# Altium schematic sheet CONTROL-SWITCHES.SchDoc
size A4; SheetNumber: 2; SheetTotal: 5
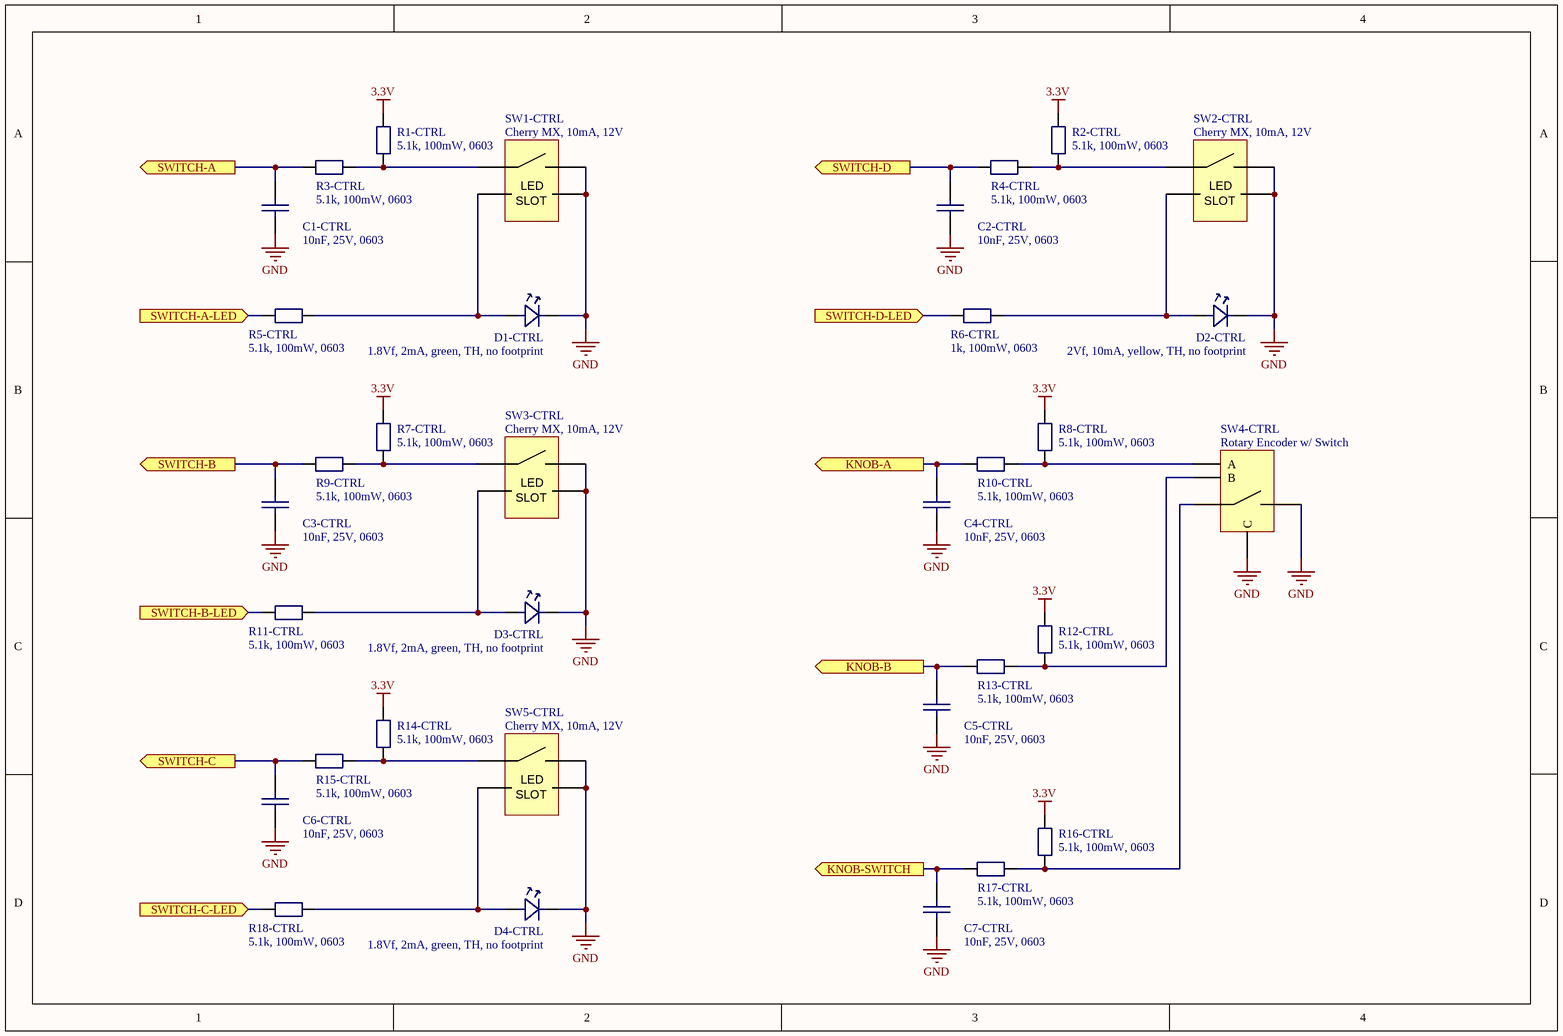
[diagram p0: CONTROL-SWITCHES.SchDoc]

## Parts
C1-CTRL  10nF, 25V, 0603  [0603 [1608]]
C2-CTRL  10nF, 25V, 0603  [0603 [1608]]
C3-CTRL  10nF, 25V, 0603  [0603 [1608]]
C4-CTRL  10nF, 25V, 0603  [0603 [1608]]
C5-CTRL  10nF, 25V, 0603  [0603 [1608]]
C6-CTRL  10nF, 25V, 0603  [0603 [1608]]
C7-CTRL  10nF, 25V, 0603  [0603 [1608]]
D1-CTRL  1.8Vf, 2mA, green, TH, no footprint  [LED 0603 [1608]]  (mechanical)
D2-CTRL  2Vf, 10mA, yellow, TH, no footprint  [LED 0603 [1608]]  (mechanical)
D3-CTRL  1.8Vf, 2mA, green, TH, no footprint  [LED 0603 [1608]]  (mechanical)
D4-CTRL  1.8Vf, 2mA, green, TH, no footprint  [LED 0603 [1608]]  (mechanical)
R1-CTRL  5.1k, 100mW, 0603  [0603 [1608]]
R2-CTRL  5.1k, 100mW, 0603  [0603 [1608]]
R3-CTRL  5.1k, 100mW, 0603  [0603 [1608]]
R4-CTRL  5.1k, 100mW, 0603  [0603 [1608]]
R5-CTRL  5.1k, 100mW, 0603  [0603 [1608]]
R6-CTRL  1k, 100mW, 0603  [0603 [1608]]
R7-CTRL  5.1k, 100mW, 0603  [0603 [1608]]
R8-CTRL  5.1k, 100mW, 0603  [0603 [1608]]
R9-CTRL  5.1k, 100mW, 0603  [0603 [1608]]
R10-CTRL  5.1k, 100mW, 0603  [0603 [1608]]
R11-CTRL  5.1k, 100mW, 0603  [0603 [1608]]
R12-CTRL  5.1k, 100mW, 0603  [0603 [1608]]
R13-CTRL  5.1k, 100mW, 0603  [0603 [1608]]
R14-CTRL  5.1k, 100mW, 0603  [0603 [1608]]
R15-CTRL  5.1k, 100mW, 0603  [0603 [1608]]
R16-CTRL  5.1k, 100mW, 0603  [0603 [1608]]
R17-CTRL  5.1k, 100mW, 0603  [0603 [1608]]
R18-CTRL  5.1k, 100mW, 0603  [0603 [1608]]
SW1-CTRL  Cherry MX, 10mA, 12V  [Cherry MX Switch]
SW2-CTRL  Cherry MX, 10mA, 12V  [Cherry MX Switch]
SW3-CTRL  Cherry MX, 10mA, 12V  [Cherry MX Switch]
SW4-CTRL  Rotary Encoder w/ Switch  [Rotary Encoder w/ Switch (Bourns)]
SW5-CTRL  Cherry MX, 10mA, 12V  [Cherry MX Switch]

## Ports
KNOB-A (out, see OVERVIEW[2B], MCU[1B]), KNOB-B (out, see OVERVIEW[2B], MCU[1A]), KNOB-SWITCH (out, see OVERVIEW[2B], MCU[1A]), SWITCH-A (out, see OVERVIEW[2A], MCU[1A]), SWITCH-A-LED (in, see OVERVIEW[1A], MCU[1A]), SWITCH-B (out, see OVERVIEW[2A], MCU[1A]), SWITCH-B-LED (in, see OVERVIEW[1A], MCU[1A]), SWITCH-C (out, see OVERVIEW[2A], MCU[1A]), SWITCH-C-LED (in, see OVERVIEW[1A], MCU[1A]), SWITCH-D (out, see OVERVIEW[2A], MCU[2A]), SWITCH-D-LED (in, see OVERVIEW[1A], MCU[2A])

## Nets
3.3V: R1-CTRL.2 R2-CTRL.2 R7-CTRL.2 R8-CTRL.2 R12-CTRL.2 R14-CTRL.2 R16-CTRL.2
GND: C1-CTRL.1 C2-CTRL.1 C3-CTRL.1 C4-CTRL.1 C5-CTRL.1 C6-CTRL.1 C7-CTRL.1 D1-CTRL.1 D2-CTRL.1 D3-CTRL.1 D4-CTRL.1 SW1-CTRL.2 SW1-CTRL.4 SW2-CTRL.2 SW2-CTRL.4 SW3-CTRL.2 SW3-CTRL.4 SW4-CTRL.2 SW4-CTRL.C SW5-CTRL.2 SW5-CTRL.4
KNOB-A: C4-CTRL.2 R10-CTRL.2 ; port KNOB-A
KNOB-B: C5-CTRL.2 R13-CTRL.2 ; port KNOB-B
KNOB-SWITCH: C7-CTRL.2 R17-CTRL.2 ; port KNOB-SWITCH
SWITCH-A: C1-CTRL.2 R3-CTRL.2 ; port SWITCH-A
SWITCH-A-LED: R5-CTRL.1 ; port SWITCH-A-LED
SWITCH-B: C3-CTRL.2 R9-CTRL.2 ; port SWITCH-B
SWITCH-B-LED: R11-CTRL.1 ; port SWITCH-B-LED
SWITCH-C: C6-CTRL.2 R15-CTRL.2 ; port SWITCH-C
SWITCH-C-LED: R18-CTRL.1 ; port SWITCH-C-LED
SWITCH-D: C2-CTRL.2 R4-CTRL.2 ; port SWITCH-D
SWITCH-D-LED: R6-CTRL.1 ; port SWITCH-D-LED
NetD1-CTRL_2: D1-CTRL.2 R5-CTRL.2 SW1-CTRL.3
NetD2-CTRL_2: D2-CTRL.2 R6-CTRL.2 SW2-CTRL.3
NetD3-CTRL_2: D3-CTRL.2 R11-CTRL.2 SW3-CTRL.3
NetD4-CTRL_2: D4-CTRL.2 R18-CTRL.2 SW5-CTRL.3
NetR1-CTRL_1: R1-CTRL.1 R3-CTRL.1 SW1-CTRL.1
NetR2-CTRL_1: R2-CTRL.1 R4-CTRL.1 SW2-CTRL.1
NetR7-CTRL_1: R7-CTRL.1 R9-CTRL.1 SW3-CTRL.1
NetR8-CTRL_1: R8-CTRL.1 R10-CTRL.1 SW4-CTRL.A
NetR12-CTRL_1: R12-CTRL.1 R13-CTRL.1 SW4-CTRL.B
NetR14-CTRL_1: R14-CTRL.1 R15-CTRL.1 SW5-CTRL.1
NetR16-CTRL_1: R16-CTRL.1 R17-CTRL.1 SW4-CTRL.1

## Notes on the sheet
- (in symbol Cherry MX Switch) LED; SLOT

## Library data of the parts
C1-CTRL C2-CTRL C3-CTRL C4-CTRL C5-CTRL C6-CTRL C7-CTRL = Capacitor: Manufacturer: YAGEO; Manufacturer ID: CC0603KRX7R8BB103; Supplier: Farnell; Supplier ID: 3019561; URL: https://ee.farnell.com/yageo/cc0603krx7r8bb103/cap-0-01-f-25v-10-x7r-0603/dp/3019561
D1-CTRL D3-CTRL D4-CTRL = LED: Manufacturer: MULTICOMP PRO; Manufacturer ID: MP008246; Supplier: Farnell; Supplier ID: 3796272; URL: https://ee.farnell.com/multicomp-pro/mp008246/led-green-1-5mcd-572nm-3mm/dp/3796272?st=led%203mm
D2-CTRL = LED: Manufacturer: BROADCOM; Manufacturer ID: HLMP-1401; Supplier: Farnell; Supplier ID: 1003198; URL: https://ee.farnell.com/broadcom-limited/hlmp-1401/led-3mm-yellow-2-2mcd-585nm/dp/1003198
R1-CTRL R2-CTRL R3-CTRL R4-CTRL R5-CTRL R7-CTRL R8-CTRL R9-CTRL R10-CTRL R11-CTRL R12-CTRL R13-CTRL R14-CTRL R15-CTRL R16-CTRL R17-CTRL R18-CTRL = Resistor: Manufacturer: YAGEO; Manufacturer ID: RC0603FR-075K1L; Supplier: Farnell; Supplier ID: 3495881; URL: https://ee.farnell.com/yageo/rc0603fr-075k1l/res-5k1-1-0-1w-0603-thick-film/dp/3495881
R6-CTRL = Resistor: Manufacturer: KOA; Manufacturer ID: RK73H1JTTD1001F.; Supplier: Farnell; Supplier ID: 3548613; URL: https://ee.farnell.com/koa-speer-electronics/rk73h1jttd1001f/res-1k-1-0-125w-0603/dp/3548613
SW1-CTRL SW2-CTRL SW3-CTRL SW5-CTRL = Cherry MX Switch: Manufacturer: Cherry Americas LLC; Manufacturer ID: MX1A-11NW; Supplier: Digi-Key; Supplier ID: CH160-ND; URL: https://www.digikey.ee/en/products/detail/cherry-americas-llc/MX1A-11NW/91134
SW4-CTRL = Rotary Encoder w/ Switch: Manufacturer: Bourns; Manufacturer ID: PEC11H-4015F-S0016; Supplier: Digi-Key; Supplier ID: 118-PEC11H-4015F-S0016-ND; URL: https://www.digikey.ee/en/products/detail/bourns-inc/PEC11H-4015F-S0016/12349530